# Altium project JLink-OB-Wiki.PrjPCB
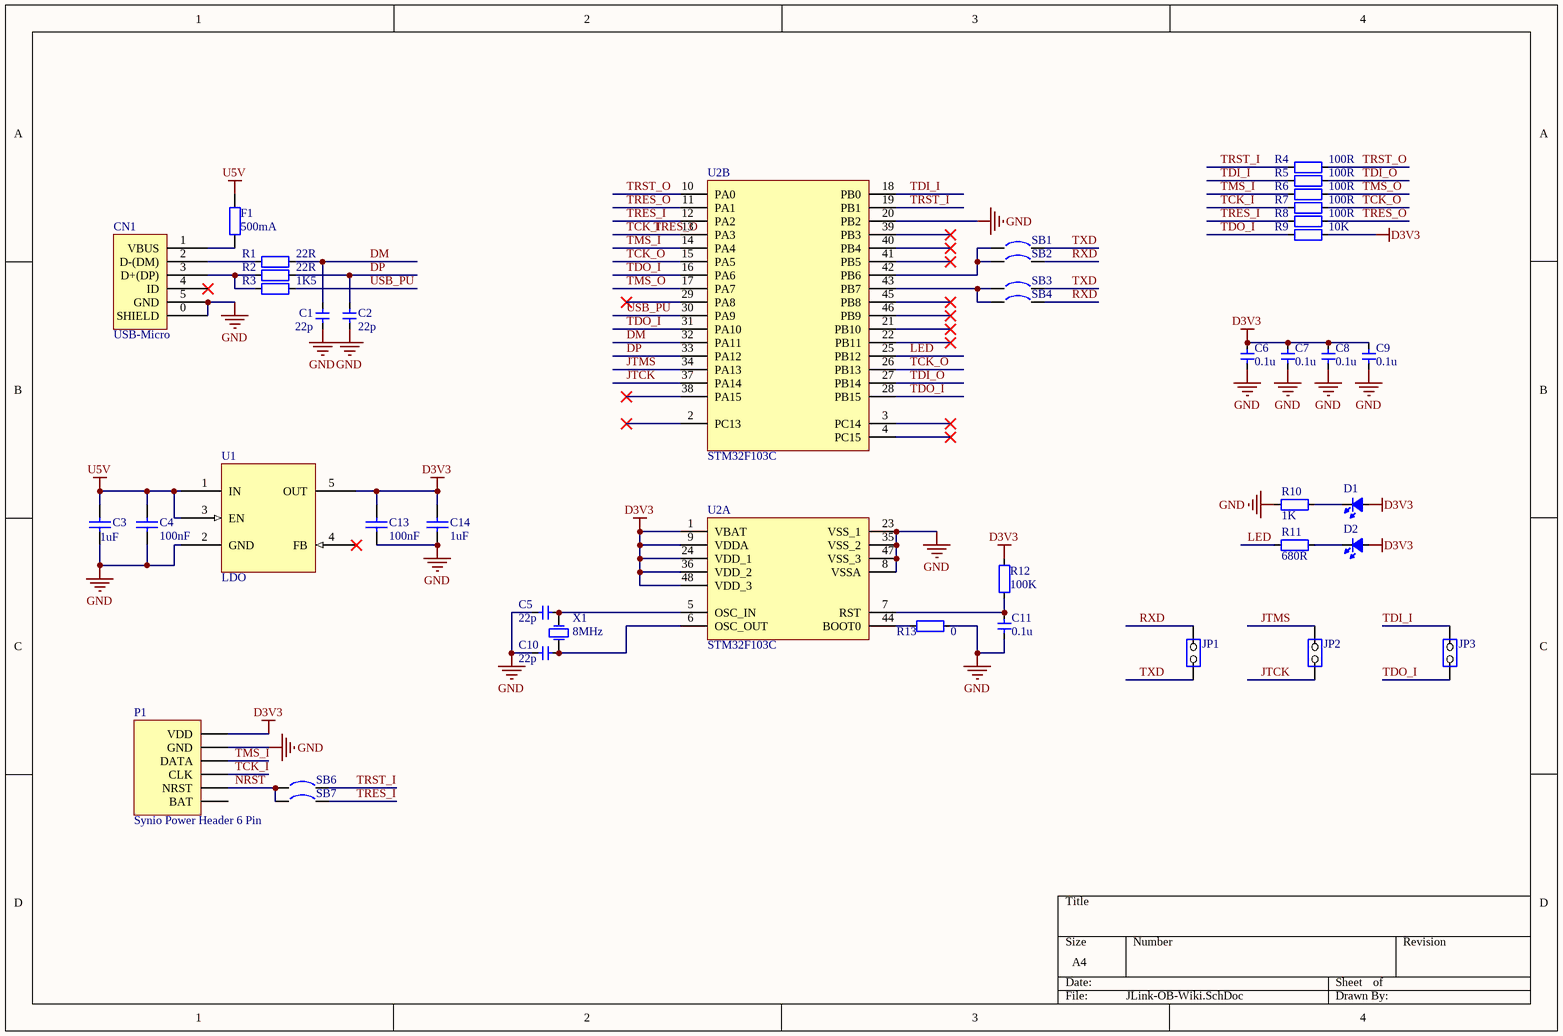
[diagram p0: JLink-OB-Wiki.SchDoc]
1 sheet, 43 parts. Net scope: global (net labels, ports and power ports of the same name join across sheets).
Board file: JLink-OB-Wiki.PcbDoc

## Sheet JLink-OB-Wiki.SchDoc
size A4

### Parts
C1  value 22p  [0603C]  (hidden comment: Cap_0603)
C2  value 22p  [0603C]  (hidden comment: Cap_0603)
C3  1uF  [0603C]
C4  100nF  [0603C]
C5  value 22p  [0603C]  (hidden comment: Cap_0603)
C6  value 0.1u  [0603C]  (hidden comment: Cap_0603)
C7  value 0.1u  [0603C]  (hidden comment: Cap_0603)
C8  value 0.1u  [0603C]  (hidden comment: Cap_0603)
C9  value 0.1u  [0603C]  (hidden comment: Cap_0603)
C10  value 22p  [0603C]  (hidden comment: Cap_0603)
C11  value 0.1u  [0603C]  (hidden comment: Cap_0603)
C13  100nF  [0603C]
C14  1uF  [0603C]
CN1  USB-Micro  [USB_MICRO_5S_B]
D1  LED_0603  [LED-0603]  (value not drawn)
D2  LED_0603  [LED-0603]  (value not drawn)
F1  500mA  [0805M]
JP1  JP2  [HDR1X2/2.54mm]  (value not drawn)
JP2  JP2  [HDR1X2/2.54mm]  (value not drawn)
JP3  JP2  [HDR1X2/2.54mm]  (value not drawn)
P1  Synio Power Header 6 Pin  [HDR1X6/2.54MM]
R1  value 22R  [0603R]  (hidden comment: Res_0603)
R2  value 22R  [0603R]  (hidden comment: Res_0603)
R3  value 1K5  [0603R]  (hidden comment: Res_0603)
R4  value 100R  [0603R]  (hidden comment: Res_0603)
R5  value 100R  [0603R]  (hidden comment: Res_0603)
R6  value 100R  [0603R]  (hidden comment: Res_0603)
R7  value 100R  [0603R]  (hidden comment: Res_0603)
R8  value 100R  [0603R]  (hidden comment: Res_0603)
R9  value 10K  [0603R]  (hidden comment: Res_0603)
R10  value 1K  [0603R]  (hidden comment: Res_0603)
R11  value 680R  [0603R]  (hidden comment: Res_0603)
R12  value 100K  [0603R]  (hidden comment: Res_0603)
R13  value 0  [0603R]  (hidden comment: Res_0603)
SB1  Circuit Breaker  [JP2_SMD]  (value not drawn)
SB2  Circuit Breaker  [JP2_SMD]  (value not drawn)
SB3  Circuit Breaker  [JP2_SMD]  (value not drawn)
SB4  Circuit Breaker  [JP2_SMD]  (value not drawn)
SB6  Circuit Breaker  [JP2_SMD]  (value not drawn)
SB7  Circuit Breaker  [JP2_SMD]  (value not drawn)
U1  LDO  [SOT23-5]
U2  STM32F103C  [LQFP48_N]  (parts A,B of 2)
X1  value 8MHz  [XTAL]  (hidden comment: XTAL_5032_2P)

### Nets
D3V3: C6.1 C7.1 C8.1 C9.1 C13.2 C14.1 D1.1(A) D2.1(A) P1.1(VDD) R9.2 R12.2 U1.5(OUT) U2.1(VBAT) U2.9(VDDA) U2.24(VDD_1) U2.36(VDD_2) U2.48(VDD_3)
GND: C1.1 C2.1 C3.1 C4.1 C5.2 C6.2 C7.2 C8.2 C9.2 C10.2 C11.2 C13.1 C14.2 CN1.0(SHIELD) CN1.5(GND) P1.2(GND) R10.1 R13.1 U1.2(GND) U2.8(VSSA) U2.20(PB2) U2.23(VSS_1) U2.35(VSS_2) U2.47(VSS_3)
U5V: C3.2 C4.2 F1.2 U1.1(IN) U1.3(EN)
DM: C1.2 R1.2 U2.32(PA11)
DP: C2.2 R2.2 U2.33(PA12)
JTCK: JP2.1(COMMON) U2.37(PA14)
JTMS: JP2.2(NO) U2.34(PA13)
LED: R11.1 U2.25(PB12)
NRST: P1.5(NRST) SB6.1 SB7.1
RXD: JP1.2(NO) SB2.2 SB4.2
TCK_I: P1.4(CLK) R7.1 R8.2 U2.11(PA1) U2.13(PA3)  [also labelled TRES_O]
TCK_O: R7.2 U2.15(PA5) U2.26(PB13)
TDI_I: JP3.2(NO) R5.1 U2.18(PB0)
TDI_O: R5.2 U2.27(PB14)
TDO_I: JP3.1(COMMON) R9.1 U2.16(PA6) U2.28(PB15) U2.31(PA10)
TMS_I: P1.3(DATA) R6.1 U2.14(PA4)
TMS_O: R6.2 U2.17(PA7)
TRES_I: R8.1 SB7.2 U2.12(PA2)
TRST_I: R4.1 SB6.2 U2.19(PB1)
TRST_O: R4.2 U2.10(PA0)
TXD: JP1.1(COMMON) SB1.2 SB3.2
USB_PU: R3.2 U2.30(PA9)
NetC5_1: C5.1 U2.5(OSC_IN) X1.2(OSC2)
NetC10_1: C10.1 U2.6(OSC_OUT) X1.1(OSC1)
NetC11_1: C11.1 R12.1 U2.7(RST)
NetCN1_1: CN1.1(VBUS) F1.1
NetCN1_2: CN1.2(D-(DM)) R1.1
NetCN1_3: CN1.3(D+(DP)) R2.1 R3.1
NetD1_2: D1.2(K) R10.2
NetD2_2: D2.2(K) R11.2
NetR13_2: R13.2 U2.44(BOOT0)
NetSB1_1: SB1.1 SB2.1 U2.42(PB6)
NetSB3_1: SB3.1 SB4.1 U2.43(PB7)

Not connected (* = marked no-connect by the designer): CN1 4(ID)*; P1 6(BAT); U1 4(FB)*; U2 2(PC13)* 3(PC14)* 4(PC15)* 21(PB10)* 22(PB11)* 29(PA8)* 38(PA15)* 39(PB3)* 40(PB4)* 41(PB5)* 45(PB8)* 46(PB9)*

### Library data of the parts
C1 C2 C5-C11 = Cap_0603: Capacitor
C3 C14 = CAP SMD 0603  X5R 1礔 25V 10%: 0603  X5R 1礔; Rated voltage: 25V; Tolerance: 10%; Manufacturer: *; Manufacturer P/N: *; Order code Farnell: 1288202RL; Value: 1礔; Power: *; Technology: X5R; Temperature  Factor: *; Temperature Max: +125癈; Temperature Min: -55癈; STS Code: *
C4 C13 = Capacitor_ST: Capacitor 0402 / 0603 / 0805; Revision: July-2002: Re-released for DXP Platform.; Value: 100nF
D1 D2 = LED_0603: LED
F1 = Res: Resistor; Published: 8-Jun-2000; LatestRevisionDate: 17-Jul-2002; LatestRevisionNote: Re-released for DXP Platform.; PackageReference: AXIAL-0.4; Publisher: Altium Limited; Value: 500mA
R1-R13 = Res_0603: Resistor
SB1-SB4 SB6 SB7 = Circuit Breaker: Solder: YES; Published: 24-Mar-1999; Revision: July-2002: Re-released for DXP Platform.; Publisher: Altium Limited
U1 = LDO-SOT23-5: General LDO SOT23-5
U2 = STM32F103C: MCU
X1 = XTAL_5032_2P: Crystal Oscillator